# EAGLE design Bluetooth (EAGLE 5.10)
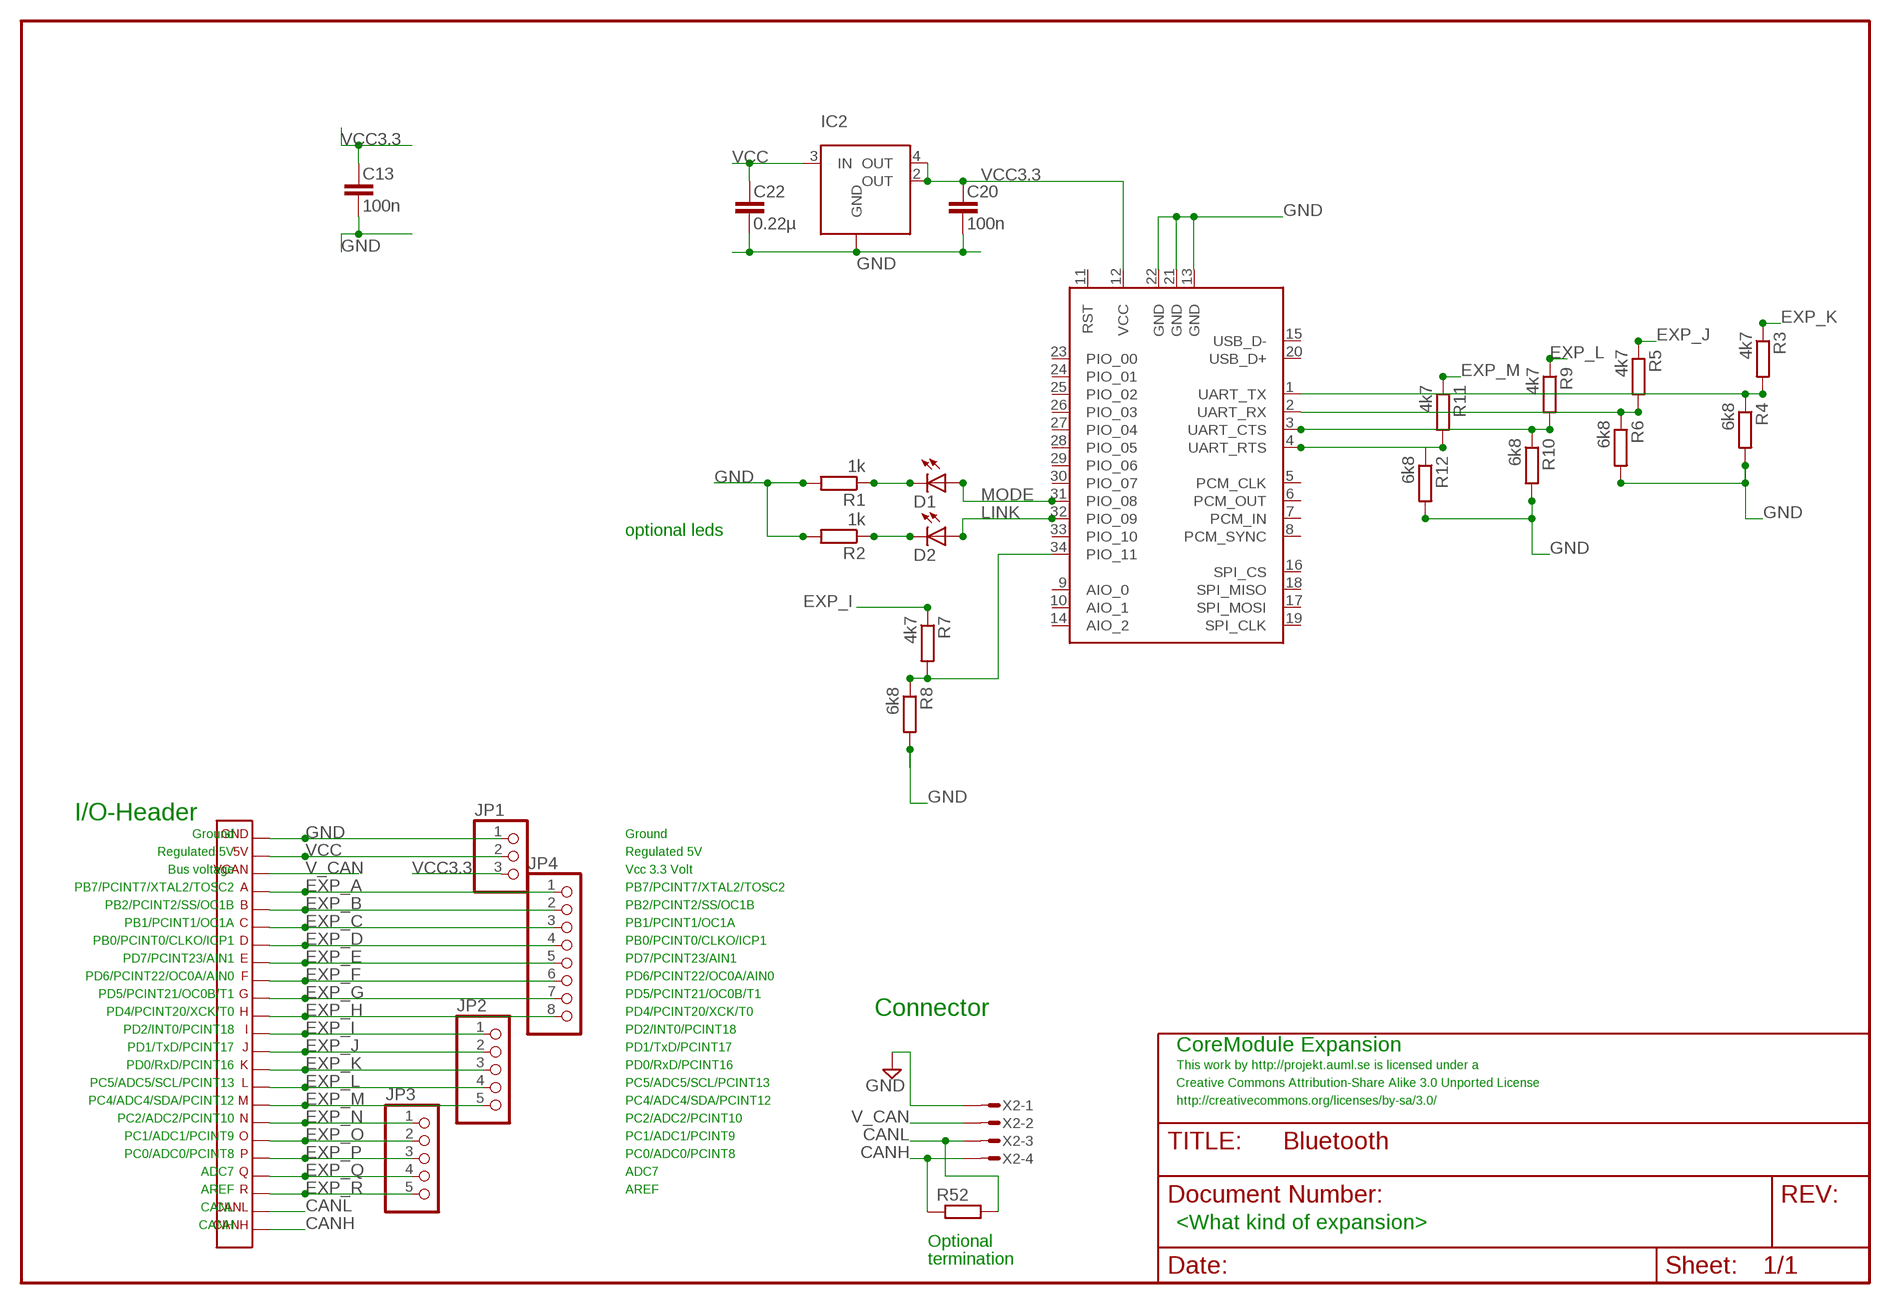
[diagram p0: schematic, sheet 1]

## Parts
C13  100n  C-EUC0603  [C0603]
C20  100n  C-EUC0603  [C0603]
C22  0.22µ  C-EUC0603  [C0603]
D1  LED  [0603]
D2  LED  [0603]
IC2  LM1117MP-3.3  [SOT223]
JP1  PINHD-1X3  [1X03]
JP2  PINHD-1X5  [1X05]
JP3  PINHD-1X5  [1X05]
JP4  PINHD-1X8  [1X08]
R1  1k  R-EUR0603  [R0603]
R2  1k  R-EUR0603  [R0603]
R3  4k7  R-EUR0603  [R0603]
R4  6k8  R-EUR0603  [R0603]
R5  4k7  R-EUR0603  [R0603]
R6  6k8  R-EUR0603  [R0603]
R7  4k7  R-EUR0603  [R0603]
R8  6k8  R-EUR0603  [R0603]
R9  4k7  R-EUR0603  [R0603]
R10  6k8  R-EUR0603  [R0603]
R11  4k7  R-EUR0603  [R0603]
R12  6k8  R-EUR0603  [R0603]
R52  R-EUR0603  [R0603]
U$1  BT_BC4  [BC4]
X1  CORETWO_LAYOUTISPHOLES_CU  [CORETWO_LAYOUT_ISPHOLES_CU]
X2  MICROMATCH-4  [MICROMATCH-4]

## Nets
CANH: R52.1 X1.CANH X2.4
CANL: R52.2 X1.CANL X2.3
EXP_A: JP4.1 X1.A
EXP_B: JP4.2 X1.B
EXP_C: JP4.3 X1.C
EXP_D: JP4.4 X1.D
EXP_E: JP4.5 X1.E
EXP_F: JP4.6 X1.F
EXP_G: JP4.7 X1.G
EXP_H: JP4.8 X1.H
EXP_I: JP2.1 R7.1 X1.I
EXP_J: JP2.2 R5.1 X1.J
EXP_K: JP2.3 R3.1 X1.K
EXP_L: JP2.4 R9.1 X1.L
EXP_M: JP2.5 R11.1 X1.M
EXP_N: JP3.1 X1.N
EXP_O: JP3.2 X1.O
EXP_P: JP3.3 X1.P
EXP_Q: JP3.4 X1.Q
EXP_R: JP3.5 X1.R
GND: C13.2 C20.2 C22.2 IC2.1(GND) JP1.1 R1.2 R2.2 R4.2 R6.2 R8.2 R10.2 R12.2 U$1.13(GND) U$1.21(GND) U$1.22(GND) X1.GND X2.1
LINK: D2.A U$1.32(PIO_09)
MODE: D1.A U$1.31(PIO_08)
N$1: D1.C R1.1
N$2: D2.C R2.1
N$3: R3.2 R4.1 U$1.1(UART_TX)
N$4: R5.2 R6.1 U$1.2(UART_RX)
N$6: R7.2 R8.1 U$1.34(PIO_11)
N$7: R9.2 R10.1 U$1.3(UART_CTS)
N$8: R11.2 R12.1 U$1.4(UART_RTS)
V_CAN: X1.VCAN X2.2
VCC: C22.1 IC2.3(IN) JP1.2 X1.5V
VCC3.3: C13.1 C20.1 IC2.2(OUT) IC2.4(OUT) JP1.3 U$1.12(VCC)
Unconnected: U$1.5(PCM_CLK) U$1.6(PCM_OUT) U$1.7(PCM_IN) U$1.8(PCM_SYNC) U$1.9(AIO_0) U$1.10(AIO_1) U$1.11(RST) U$1.14(AIO_2) U$1.15(USB_D-) U$1.16(SPI_CS) U$1.17(SPI_MOSI) U$1.18(SPI_MISO) U$1.19(SPI_CLK) U$1.20(USB_D+) U$1.23(PIO_00) U$1.24(PIO_01) U$1.25(PIO_02) U$1.26(PIO_03) U$1.27(PIO_04) U$1.28(PIO_05) U$1.29(PIO_06) U$1.30(PIO_07) U$1.33(PIO_10)

## Notes on the sheet
- optional leds
- I/O-Header
- Ground | Ground
- Regulated 5V | Regulated 5V
- Bus voltage | Vcc 3.3 Volt
- PB7/PCINT7/XTAL2/TOSC2 | PB7/PCINT7/XTAL2/TOSC2
- PB2/PCINT2/SS/OC1B | PB2/PCINT2/SS/OC1B
- PB1/PCINT1/OC1A | PB1/PCINT1/OC1A
- PB0/PCINT0/CLKO/ICP1 | PB0/PCINT0/CLKO/ICP1
- PD7/PCINT23/AIN1 | PD7/PCINT23/AIN1
- PD6/PCINT22/OC0A/AIN0 | PD6/PCINT22/OC0A/AIN0
- PD5/PCINT21/OC0B/T1 | PD5/PCINT21/OC0B/T1
- PD4/PCINT20/XCK/T0 | PD4/PCINT20/XCK/T0 | Connector
- PD2/INT0/PCINT18 | PD2/INT0/PCINT18
- PD1/TxD/PCINT17 | PD1/TxD/PCINT17 | CoreModule Expansion
- PD0/RxD/PCINT16 | PD0/RxD/PCINT16 | This work by http://projekt.auml.se is licensed under a
- PC5/ADC5/SCL/PCINT13 | PC5/ADC5/SCL/PCINT13 | Creative Commons Attribution-Share Alike 3.0 Unported License
- PC4/ADC4/SDA/PCINT12 | PC4/ADC4/SDA/PCINT12 | http://creativecommons.org/licenses/by-sa/3.0/
- PC2/ADC2/PCINT10 | PC2/ADC2/PCINT10
- PC1/ADC1/PCINT9 | PC1/ADC1/PCINT9
- PC0/ADC0/PCINT8 | PC0/ADC0/PCINT8
- ADC7 | ADC7
- AREF | AREF
- CANL
- CANH | <What kind of expansion>
- Optional
- termination

## Library data of the parts
C13 C20 C22 = rcl:C-EU
D1 D2 = led:LED
IC2 = lm1117mp:LM1117MP-3.3
JP1 = pinhead:PINHD-1X3: PIN HEADER
JP2 JP3 = pinhead:PINHD-1X5: PIN HEADER
JP4 = pinhead:PINHD-1X8: PIN HEADER
R1-R12 R52 = rcl:R-EU
U$1 = bluetooth:BT_BC4
X1 = expboard:CORETWO_LAYOUT
X2 = con-amp-micromatch:MICROMATCH-4: MicroMaTch 4 7-215464-4 / 0-215464-4 Drawing Number C-215464 DDEController.pdf

## Board
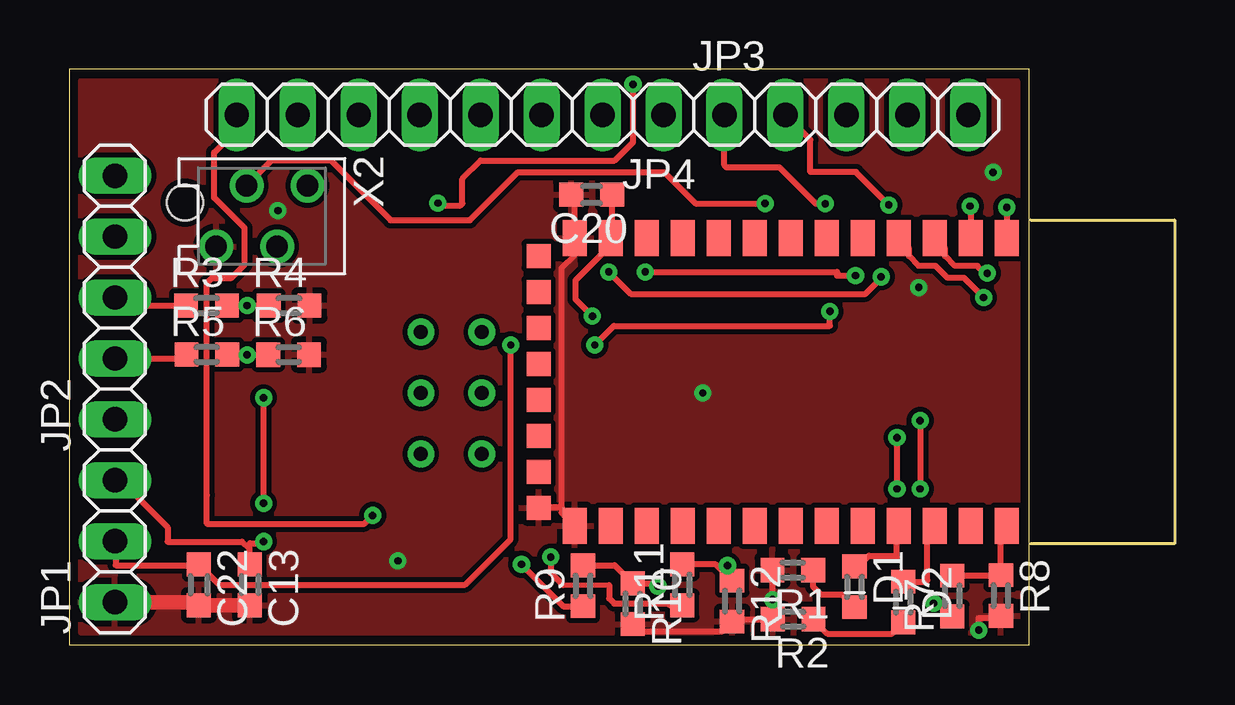
[diagram p1: board, top side]
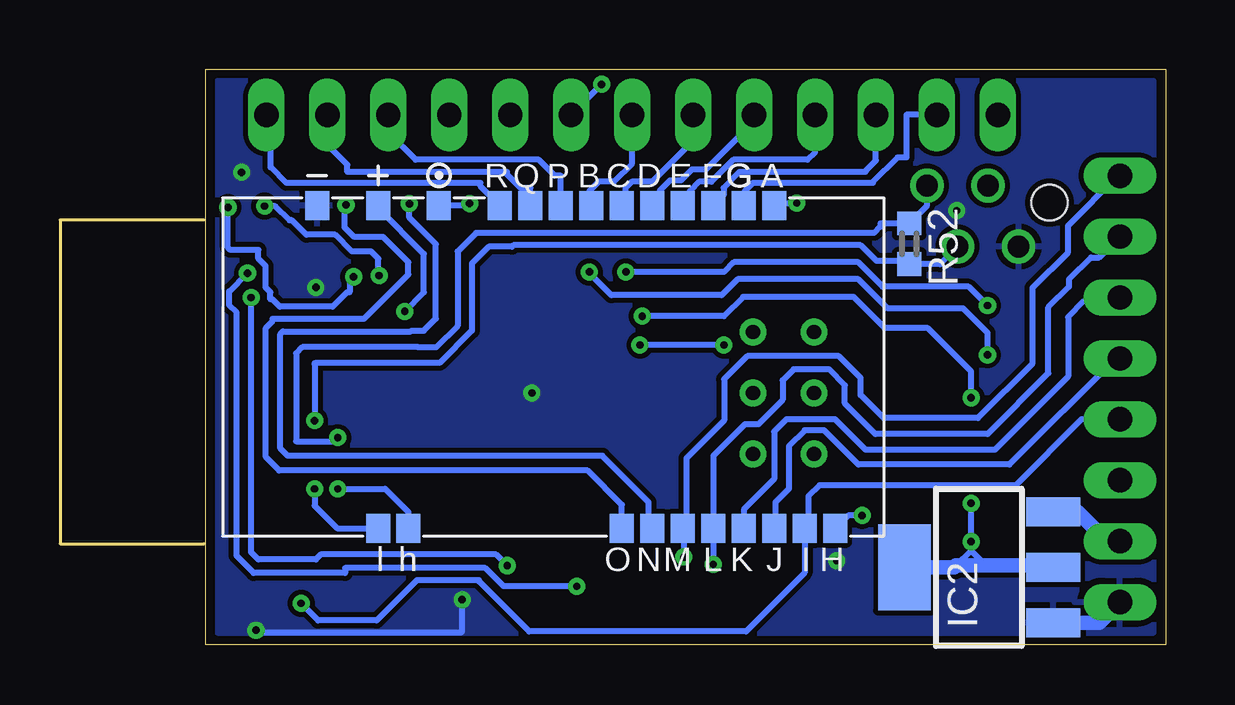
[diagram p2: board, bottom side, seen from below]

Size 40 x 24 mm. Coordinates in mm from the lower left corner, seen from the top.
Outline: 0,0 40,0 40,24 0,24 0,0
Copper layers (1*16): Top 0.035mm / dielectric 1.5mm / Bottom 0.035mm
Design rules "ITead_rule *": minimum track width 8mil, minimum drill 12mil, track to track 8mil, track to pad 8mil, pad to pad 8mil, via to via 8mil, smd to smd 0mil, copper to edge 10mil, drill to drill 10mil, minimum pad ring 10mil, minimum via ring 8mil, stop-mask expansion 2mil, vias tented up to drill 100mil, thermal gap 10mil

### Footprints (pad centres in the part's own frame; a part is rotated, then mirrored left to right if it is on the bottom)
C0603 = smd 1 x 1: 1 -0.85,0; 2 0.85,0
0603 = smd 0.991 x 1.016: A -0.85,0; C 0.85,0
SOT223 = smd 1.219 x 2.235: 1 -2.311,-3.099; 2 0,-3.099; 3 2.311,-3.099 | smd 3.6 x 2.2: 4 0,3.099
1X03 = drill 1.016 long: 1 -2.54,0; 2 0,0; 3 2.54,0
1X05 = drill 1.016 long: 1 -5.08,0; 2 -2.54,0; 3 0,0; 4 2.54,0; 5 5.08,0
1X08 = drill 1.016 long: 1 -8.89,0; 2 -6.35,0; 3 -3.81,0; 4 -1.27,0; 5 1.27,0; 6 3.81,0; 7 6.35,0; 8 8.89,0
R0603 = smd 0.991 x 1.016: 1 -0.85,0; 2 0.85,0
BC4 = smd 1.5 x 1: 1 -5.75,9.5; 2 -5.75,8; 3 -5.75,6.5; 4 -5.75,5; 5 -5.75,3.5; 6 -5.75,2; 7 -5.75,0.5; 8 -5.75,-1; 9 -5.75,-2.5; 10 -5.75,-4; 11 -5.75,-5.5; 12 -5.75,-7; 13 -5.75,-8.5; 22 6.25,-8.5; 23 6.25,-7; 24 6.25,-5.5; 25 6.25,-4; 26 6.25,-2.5; 27 6.25,-1; 28 6.25,0.5; 29 6.25,2; 30 6.25,3.5; 31 6.25,5; 32 6.25,6.5; 33 6.25,8; 34 6.25,9.5 | smd 1 x 1: 14 -5,-10; 15 -3.5,-10; 16 -2,-10; 17 -0.5,-10; 18 1,-10; 19 2.5,-10; 20 4,-10; 21 5.5,-10
CORETWO_LAYOUT_ISPHOLES_CU = smd 1 x 1.2: 5V 7.315,-6.648; A -9.195,-6.648; B -1.575,-6.648; C -2.845,-6.648; CANH 6.045,6.814; CANL 7.315,6.814; D -4.115,-6.648; E -5.385,-6.648; F -6.655,-6.648; G -7.925,-6.648; GND 9.855,-6.648; H -11.735,6.814; I -10.465,6.814; J -9.195,6.814; K -7.925,6.814; L -6.655,6.814; M -5.385,6.814; N -4.115,6.814; O -2.845,6.814; P -0.305,-6.648; Q 0.965,-6.648; R 2.235,-6.648; VCAN 4.775,-6.648 | drill 0.6 round: P$1 -10.846,3.708; P$2 -8.306,3.708; P$3 -10.846,1.168; P$4 -8.306,1.168; P$5 -8.306,-1.372; P$6 -10.846,-1.372
MICROMATCH-4 = drill 0.9 round: 1 1.905,1.27; 2 0.635,-1.27; 3 -0.635,1.27; 4 -1.905,-1.27 | hole 1.5: 3.199,-0.562

### Placement (x,y rotation side)
C13  7.53,2.5 270 top
C20  21.77,18.77 180 top
C22  5.4,2.5 270 top
D1  32.72,2.42 270 top
D2  34.76,1.78 270 top
IC2  7.78,3.23 90 bottom
JP1  1.91,4.32 90 top
JP2  1.91,14.48 90 top
JP3  32.38,22.1 0 top
JP4  15.88,22.1 180 top
R1  30.15,3.11 180 top
R2  30.17,1.07 180 top
R3  5.72,14.14 0 top
R4  9.17,14.14 0 top
R5  5.74,12.1 0 top
R6  9.15,12.1 0 top
R7  36.8,2.04 90 top
R8  38.82,2.05 270 top
R9  21.41,2.46 90 top
R10  23.48,1.71 270 top
R11  25.54,2.5 90 top
R12  27.62,1.82 270 top
R52  10.68,16.72 270 bottom
U$1  29.56,11.21 270 top
X1  25.5,11.67 180 bottom
X2  8.03,17.87 180 top

### Tracks (layer width: path | path; a pad name or v marks a point on that pad's centre or on a via)
CANH  (via drill 0.3)
  Top 0.254: v34.49,8.64 v34.49,6.5
  Bottom 0.254: X2.4 9.94,18.31 R52.1 11.88,17.57 11.88,17.43 12.14,17.17 28.73,17.17 29.5,16.4 29.5,13.3 30.4,12.4 31.13,12.4 31.14,12.41 35.96,12.41 36.22,12.15 36.22,8.48 34.65,8.48 v34.49,8.64 | v34.49,6.5 32.51,6.5 31.55,5.54 X1.CANH
CANL  (via drill 0.3)
  Top 0.254: v35.46,9.35 v35.46,6.5
  Bottom 0.254: X1.CANL 34.52,4.85 35.46,5.79 v35.46,6.5 | 35.46,11.7 v35.46,9.35 | 35.46,11.7 35.46,11.75 | X2.3 9.4,15.87 R52.2 10.81,16 12.04,16 12.7,16.66 27.18,16.66 27.24,16.6 28.2,16.6 28.9,15.9 28.9,13.1 30.25,11.75 35.41,11.75 35.46,11.7
EXP_A  (via drill 0.3)
  Top 0.254: v23.5,23.37 23.5,20.95 22.73,20.19 17.14,20.19 16.38,19.43 16.38,18.39 X1.A 15.47,18.32 v15.37,18.41
  Bottom 0.254: v23.5,23.37 JP4.1 | v15.37,18.41 16.2,18.41 X1.A
EXP_B
  Bottom 0.254: JP4.2 22.23,20.07 22.99,19.3 23.62,19.3 24,18.92 24,18.39 X1.B
EXP_C
  Bottom 0.254: 22.61,18.36 X1.C 22.5,18.46 22.5,19.05 22.25,19.3 21.39,19.3 19.74,20.95 19.74,22.05 JP4.3
EXP_D
  Bottom 0.254: JP4.4 17.2,22.05 17.2,21.77 19.15,19.81 19.74,19.81 20.19,19.36 20.65,19.36 21.06,18.95 21.06,18.74 21.4,18.4 21.4,18.3 X1.D
EXP_E
  Bottom 0.254: X1.E 19.81,18.62 19.81,18.92 19.43,19.3 18.92,19.3 18.01,20.22 14.91,20.22 14.61,20.52 JP4.5
EXP_F
  Bottom 0.254: JP4.6 12.06,20.19 12.5,19.76 12.5,19.71 17.75,19.71 18.41,19.05 18.41,18.74 X1.F
EXP_G
  Bottom 0.254: JP4.7 10.79,22.1 10.79,20.32 11.18,20.32 12.19,19.3 12.19,19.25 17.2,19.25 17.53,18.92 17.53,18.36 X1.G
EXP_H  (via drill 0.3)
  Top 0.254: JP4.8 6.99,21.46 6.04,20.52 6.04,18.64 7.32,17.37 7.32,15.85 6.76,15.29 5.94,15.29 5.74,15.09 5.74,6.25 5.74,5.04 12.3,5.04 v12.64,5.39
  Bottom 0.254: v12.64,5.39 13.23,5.39 X1.H
EXP_I  (via drill 0.3)
  Top 0.254: v36.02,1.73 36.26,1.73 R7.1
  Bottom 0.254: v36.02,1.73 35.31,1.02 32.87,1.02 31.19,2.69 28.6,2.69 28.6,2.64 26.52,0.56 17.48,0.56 15.03,3 X1.I 14.88,5 14.88,6.2 14.43,6.66 6.25,6.66 3.5,9.4 JP2.1
EXP_J
  Top 0.254: JP2.2 4.62,11.94 4.79,12.1 R5.1
  Bottom 0.254: JP2.2 2.08,11.94 6.5,7.52 12.8,7.52 14.22,8.94 15.04,8.94 15.7,8.28 15.7,6.5 16.26,5.94 16.26,4.9 X1.J
EXP_K
  Top 0.254: R3.1 2.24,14.14 JP2.3
  Bottom 0.254: X1.K 17.57,5.64 16.31,6.91 16.31,8.89 15.8,9.4 13.77,9.4 12.5,8.13 7.11,8.13 4.06,11.18 4.06,13.66 3.4,14.33 2.06,14.33 JP2.3
EXP_L  (via drill 0.3)
  Top 0.254: R9.1 20.59,1.61 v18.85,3.35
  Bottom 0.254: v18.85,3.35 X1.L 18.84,7.88 17.53,9.2 16.97,9.2 15.95,10.21 15.95,11.02 15.49,11.48 14.02,11.48 13.36,10.82 13.36,10.06 12.09,8.79 7.42,8.79 4.88,11.33 4.88,14.07 4.01,14.94 4.01,15.24 3.1,16.15 2.77,16.15 JP2.4
EXP_M  (via drill 0.3)
  Top 0.203: 20.57,2.49 22.5,2.49
  Top 0.254: 25.15,1.73 25.23,1.65 R11.1 25.02,1.65 24.94,1.73 22.71,1.73 22.5,1.93 22.5,2.49 | 20.57,2.49 20.07,3 v20.07,3.66
  Bottom 0.254: v20.07,3.66 20.07,4.81 X1.M 19.96,5 19.96,7.77 18.39,9.35 18.39,11.07 17.42,12.04 13.61,12.04 12.7,11.12 12.7,10.41 11.73,9.45 7.82,9.45 5.54,11.73 5.54,14.88 4.06,16.36 4.06,17.48 1.98,19.56 JP2.5
EXP_N  (via drill 0.3)
  Top 0.254: JP3.1 27.3,19.99 27.39,19.9 29.6,19.9 31.11,18.39 v31.51,18.39
  Bottom 0.254: X1.N 21.54,5.01 21.54,5.94 23.47,7.87 36.58,7.87 36.88,8.18 36.88,12.96 36.78,13.07 31.45,13.07 31.42,13.1 30.9,13.1 30.4,13.6 30.4,16.7 31.51,17.81 v31.51,18.39
EXP_O  (via drill 0.3)
  Top 0.254: JP3.2 30.89,21.06 30.89,19.71 32.78,19.71 v34.15,18.34
  Bottom 0.254: X1.O 22.65,5.84 24.08,7.26 36.93,7.26 37.49,7.82 37.49,13.21 37.2,13.5 37.2,13.6 33.39,13.6 31.55,15.44 31.55,15.95 32.6,17 33.8,17 34.2,17.4 34.2,18.29 v34.15,18.34
EXP_P
  Bottom 0.254: 32.38,21.61 JP3.3 32.38,21.36 31.24,20.22 26.11,20.22 25.45,19.56 25.2,19.56 X1.P
EXP_Q
  Bottom 0.254: JP3.4 34.92,20.85 34.09,20.02 34.09,19.71 27.53,19.71 | 27.53,19.71 27.43,19.71 | X1.Q 26.47,19.05 26.87,19.05 27.53,19.71
EXP_R
  Bottom 0.254: JP3.5 37.29,22.1 37.29,19.91 36.63,19.25 28.55,19.25 28.55,19.13 X1.R 27.73,18.49
GND  (via drill 0.3)
  Top 0.254: R8.2 38.74,1.12 37.9,1.12 v37.9,0.61 | R1.2 29.31,3.1 v29.31,1.88 29.31,2.07 29.32,2.08 R2.2 27.72,1.07 R12.2 27.21,0.56 23.78,0.56 R10.2 | U$1.22 20.52,5.5 20.52,5.74 | 20.52,5.74 20.52,15.7 21.06,16.24 U$1.13 21.06,18.73 21.02,18.77 C20.2 | U$1.21 19.6,5.74 20.52,5.74
  Top 0.61: JP1.1 5.27,1.78 C22.2 C13.2
  Bottom 0.254: v37.9,0.61 37.8,0.51 29.36,0.51 29.32,0.55 29.32,2.13 29.31,2.13
  Bottom 0.61: JP1.1 2.77,0.92 IC2.1
  other vias: 8.7,18.1 13.7,3.5 26.4,10.5 35.4,14.9 38.5,19.7
  pour Top: 0.5,23.5 39.5,23.5 39.5,0.5 0.5,0.5
  pour Bottom: 0.5,23.5 39.5,23.5 39.5,0.5 0.5,0.5
LINK
  Top 0.254: U$1.32 35.76,4.66 35.76,2.69 35.7,2.63 D2.A
MODE
  Top 0.254: U$1.31 34.49,4.89 34.49,3.66 34.44,3.71 33.33,3.71 32.89,3.27 D1.A
N$1
  Top 0.254: D1.C 32.21,2.08 31.34,2.08 31,2.42 R1.1
N$2
  Top 0.254: D2.C 34.28,0.46 31.6,0.46 31.02,1.04 R2.1
N$3  (via drill 0.3)
  Top 0.254: R3.2 v7.42,14.14 R4.1 | U$1.1 v39.06,18.24 | v33.83,15.34 33.83,15.29 33.17,14.63 23.4,14.63 v22.49,15.54
  Bottom 0.254: v39.06,18.24 39.06,16.56 38.96,16.46 37.8,16.46 37.8,16.09 37.5,15.8 37.5,14.9 37.3,14.7 37.3,14.4 37.2,14.4 36.9,14.1 34.7,14.1 34.1,14.7 34,14.7 34,15.17 v33.83,15.34 | v22.49,15.54 18.39,15.54 17.98,15.95 12.8,15.95 11.79,14.94 8.21,14.94 v7.42,14.14
N$4  (via drill 0.3)
  Top 0.254: U$1.2 37.56,18.27 v37.54,18.29 | v32.77,15.39 32,15.39 32,15.54 v24.01,15.54 | R5.2 v7.42,12.09 R6.1
  Bottom 0.254: v24.01,15.54 24.06,15.54 23.09,14.58 18.49,14.58 17.83,15.24 12.8,15.24 11.58,14.02 8.43,14.02 7.42,13.01 v7.42,12.09 | v37.54,18.29 37.09,18.29 36.5,17.7 36.4,17.7 35.8,17.1 34.6,17.1 33.9,16.4 33.1,16.4 32.8,16.1 32.8,15.43 v32.77,15.39
N$6
  Top 0.254: U$1.34 38.82,4.72 R8.1 38.81,2.88 R7.2
N$7  (via drill 0.3)
  Top 0.254: 36.12,16.9 U$1.3 36.5,16.52 36.5,16.2 36.9,15.8 37.85,15.8 38.15,15.49 v38.25,15.49 | v24.54,2.44 24.42,2.56 R10.1 22.73,3.31 R9.2
  Bottom 0.254: v38.25,15.49 39.01,14.73 39.01,14.17 38.71,13.87 38.71,3.71 38,3 34.19,3 34.19,3.2 28.35,3.2 27.58,2.44 v24.54,2.44
N$8  (via drill 0.3)
  Top 0.254: 27.89,2.94 R12.1 27.21,3.08 | v38.1,14.48 37.29,15.29 36.61,15.29 36.1,15.8 35.4,15.8 35,16.2 35,16.52 U$1.4 | 27.21,3.08 26.95,3.35 R11.2 | 27.21,3.08 v27.43,3.3
  Bottom 0.254: v27.43,3.3 27.89,3.76 35.2,3.76 35.41,3.56 37.8,3.56 38.1,3.86 v38.1,14.48
V_CAN  (via drill 0.3)
  Top 0.254: v29,18.4 26.1,18.4 24.8,19.7 18.7,19.7 16.7,17.7 13.4,17.7 10.9,20.2 8.45,20.2 X2.2
  Bottom 0.254: X1.VCAN 29.09,18.32 v29,18.4
VCC  (via drill 0.3)
  Top 0.254: JP1.2 1.93,4.29 1.93,3.32 5.37,3.32 C22.1 6.25,2.5 16.5,2.5 18.4,4.4 v18.4,12.5 | v31.7,13.9 31.7,13.3 22.7,13.3 v21.9,12.5
  Bottom 0.254: X1.5V 32.81,18.21 30.9,16.3 30.9,14.7 v31.7,13.9 | v18.4,12.5 v21.9,12.5
  Bottom 0.61: IC2.3 3.66,5.54 2.44,4.32 JP1.2
VCC3.3  (via drill 0.3)
  Top 0.254: C20.1 22.62,17.01 U$1.12 22.56,16.66 21.1,15.2 21.1,14.4 v21.8,13.7 | v8.1,5.9 v8.1,10.3 | JP1.3 2.14,6.86 4.1,4.9 4.1,4.3 7.2,4.3 7.5,4 7.5,3.38 C13.1 7.53,4.23 8.03,4.23 v8.1,4.3
  Top 0.61: C13.1 7.58,3.3
  Bottom 0.254: v21.8,13.7 18.4,13.7 17.6,14.5 13,14.5 11.7,13.2 9.9,13.2 8.1,11.4 v8.1,10.3 | 8.1,3.94 8.1,3.92 C13.1 | v8.1,5.9 v8.1,4.3 8.1,3.94 | 8.1,3.94 8.74,3.3
  Bottom 0.61: IC2.4 8.81,3.23 8.74,3.3 4.75,3.3 IC2.2